# EAGLE design ML_Main_V1 (EAGLE 9.2.2)
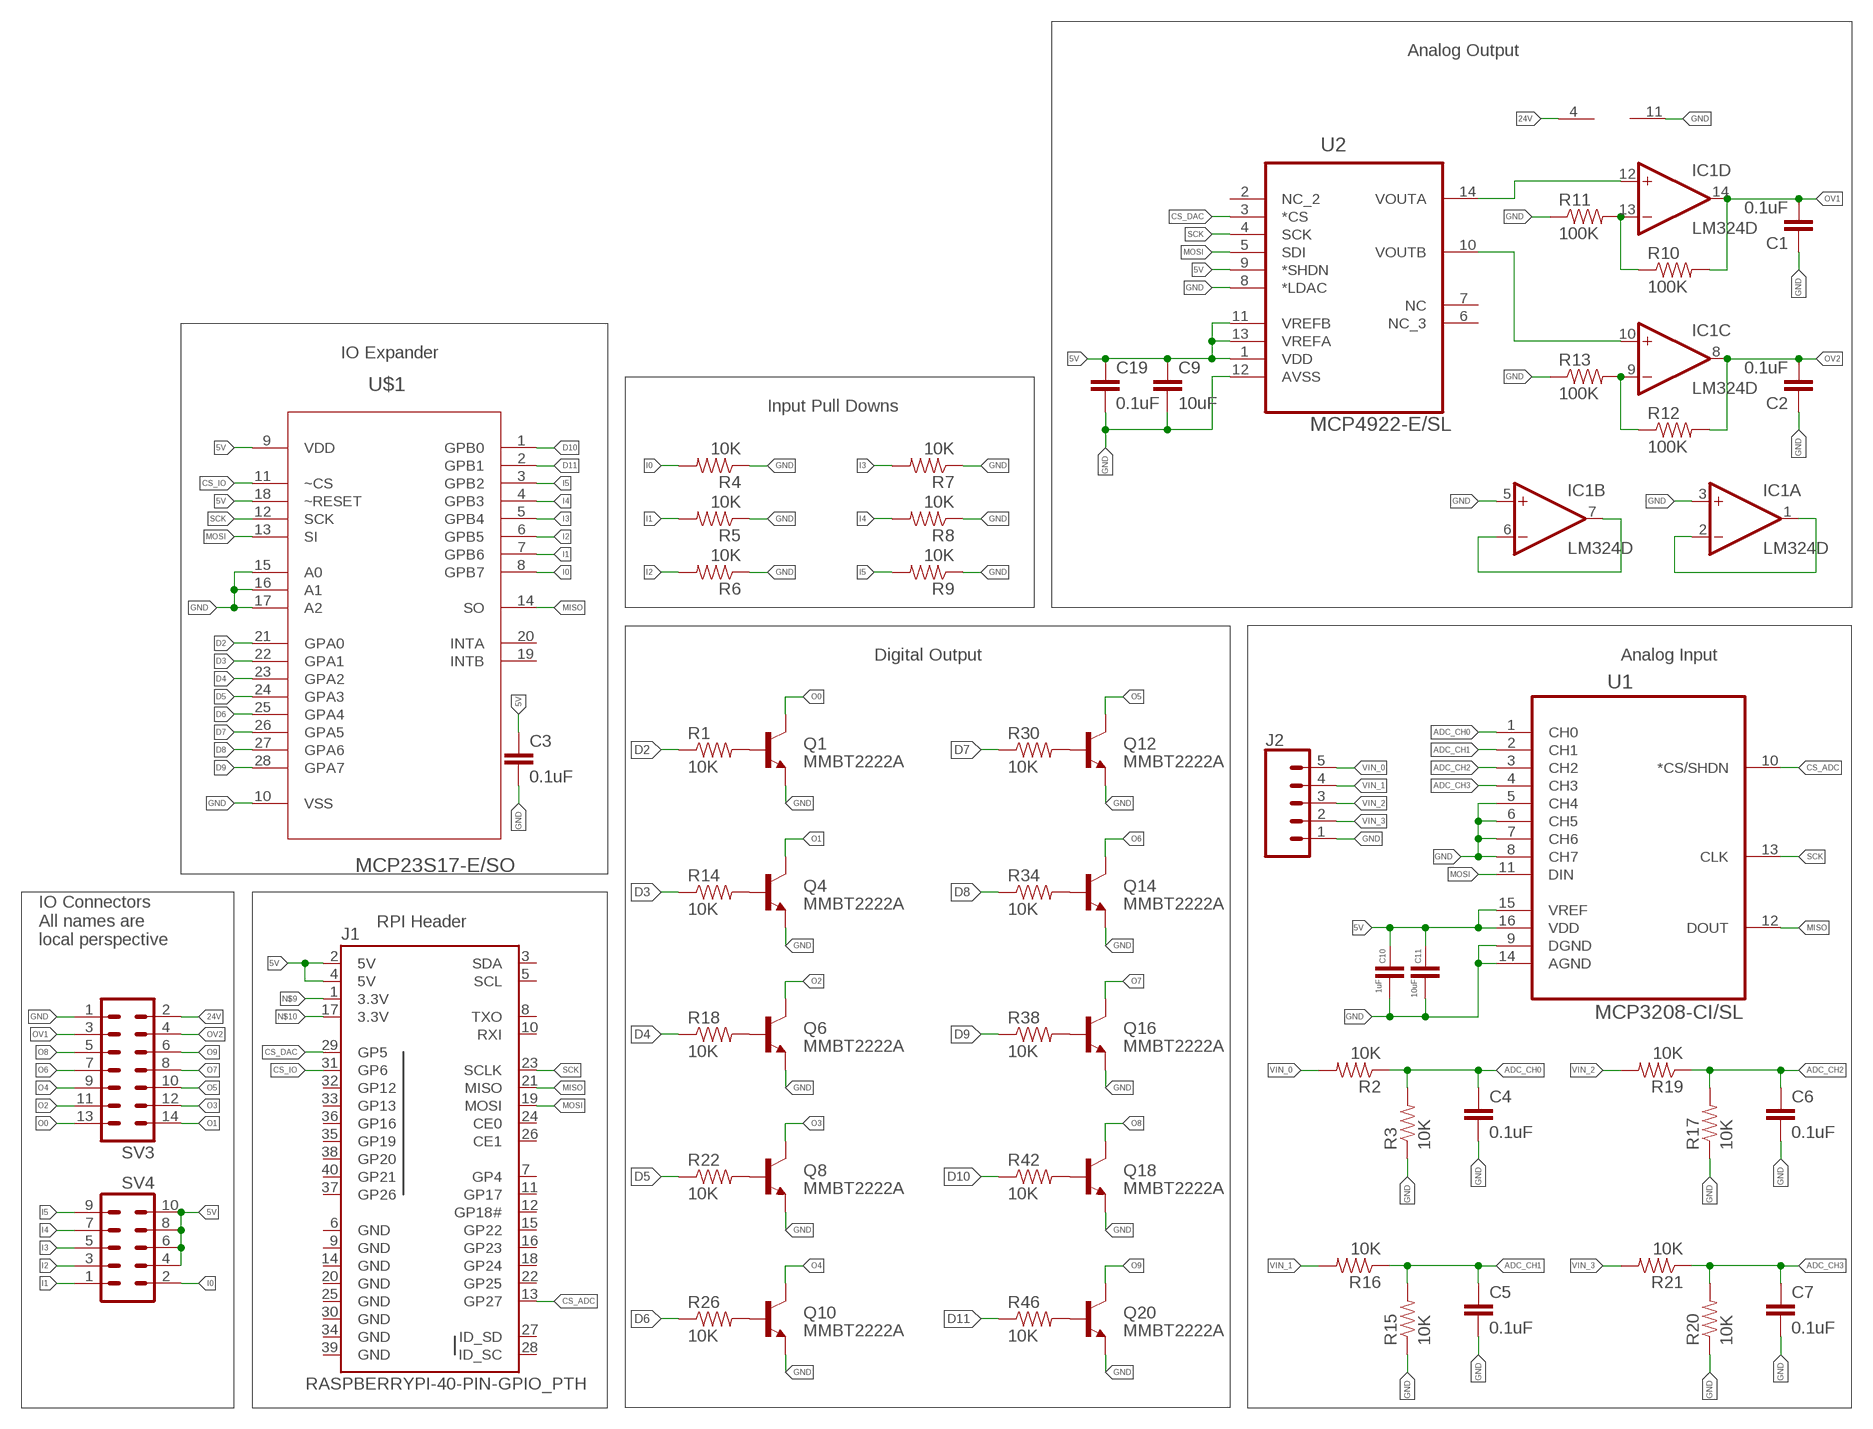
[diagram p0: schematic, sheet 1]

## Parts
C1  0.1uF  CAP0603-CAP  [0603-CAP]
C2  0.1uF  CAP0603-CAP  [0603-CAP]
C3  0.1uF  CAP0603-CAP  [0603-CAP]
C4  0.1uF  CAP0603-CAP  [0603-CAP]
C5  0.1uF  CAP0603-CAP  [0603-CAP]
C6  0.1uF  CAP0603-CAP  [0603-CAP]
C7  0.1uF  CAP0603-CAP  [0603-CAP]
C9  10uF  CAP0603-CAP  [0603-CAP]
C10  1uF  CAP0603-CAP  [0603-CAP]
C11  10uF  CAP0603-CAP  [0603-CAP]
C19  0.1uF  CAP0603-CAP  [0603-CAP]
IC1  LM324D  [SO14]
J1  RASPBERRYPI-40-PIN-GPIO_PTH  [2X20_SHROUDED]
J2  CONN_05SCREW  [SCREWTERMINAL-3.5MM-5]
Q1  MMBT2222A  TRANSISTOR_NPNMMBT2222A  [SOT23-3]
Q4  MMBT2222A  TRANSISTOR_NPNMMBT2222A  [SOT23-3]
Q6  MMBT2222A  TRANSISTOR_NPNMMBT2222A  [SOT23-3]
Q8  MMBT2222A  TRANSISTOR_NPNMMBT2222A  [SOT23-3]
Q10  MMBT2222A  TRANSISTOR_NPNMMBT2222A  [SOT23-3]
Q12  MMBT2222A  TRANSISTOR_NPNMMBT2222A  [SOT23-3]
Q14  MMBT2222A  TRANSISTOR_NPNMMBT2222A  [SOT23-3]
Q16  MMBT2222A  TRANSISTOR_NPNMMBT2222A  [SOT23-3]
Q18  MMBT2222A  TRANSISTOR_NPNMMBT2222A  [SOT23-3]
Q20  MMBT2222A  TRANSISTOR_NPNMMBT2222A  [SOT23-3]
R1  10K  RESISTOR0603-RES  [0603-RES]
R2  10K  RESISTOR0603-RES  [0603-RES]
R3  10K  RESISTOR0603-RES  [0603-RES]
R4  10K  RESISTOR0603-RES  [0603-RES]
R5  10K  RESISTOR0603-RES  [0603-RES]
R6  10K  RESISTOR0603-RES  [0603-RES]
R7  10K  RESISTOR0603-RES  [0603-RES]
R8  10K  RESISTOR0603-RES  [0603-RES]
R9  10K  RESISTOR0603-RES  [0603-RES]
R10  100K  RESISTOR0603-RES  [0603-RES]
R11  100K  RESISTOR0603-RES  [0603-RES]
R12  100K  RESISTOR0603-RES  [0603-RES]
R13  100K  RESISTOR0603-RES  [0603-RES]
R14  10K  RESISTOR0603-RES  [0603-RES]
R15  10K  RESISTOR0603-RES  [0603-RES]
R16  10K  RESISTOR0603-RES  [0603-RES]
R17  10K  RESISTOR0603-RES  [0603-RES]
R18  10K  RESISTOR0603-RES  [0603-RES]
R19  10K  RESISTOR0603-RES  [0603-RES]
R20  10K  RESISTOR0603-RES  [0603-RES]
R21  10K  RESISTOR0603-RES  [0603-RES]
R22  10K  RESISTOR0603-RES  [0603-RES]
R26  10K  RESISTOR0603-RES  [0603-RES]
R30  10K  RESISTOR0603-RES  [0603-RES]
R34  10K  RESISTOR0603-RES  [0603-RES]
R38  10K  RESISTOR0603-RES  [0603-RES]
R42  10K  RESISTOR0603-RES  [0603-RES]
R46  10K  RESISTOR0603-RES  [0603-RES]
SV3  MA07-2W  [MA07-2W]
SV4  MA05-2  [MA05-2]
U1  MCP3208-CI/SL  [SOIC127P600X175-16N]
U2  MCP4922-E/SL  [SOIC127P600X175-14N]
U$1  MCP23S17-E/SO  [SOIC127P030X265-28N]

## Nets
5V: C3.1 C9.1 C10.1 C11.1 C19.1 J1.2(5V) J1.4(5V) SV4.4 SV4.6 SV4.8 SV4.10 U1.15(VREF) U1.16(VDD) U2.1(VDD) U2.9(*SHDN) U2.11(VREFB) U2.13(VREFA) U$1.9(VDD) U$1.18(~RESET)
24V: IC1.4(P:V+) SV3.2
ADC_CH0: C4.1 R2.1 R3.2 U1.1(CH0)
ADC_CH1: C5.1 R15.2 R16.1 U1.2(CH1)
ADC_CH2: C6.1 R17.2 R19.1 U1.3(CH2)
ADC_CH3: C7.1 R20.2 R21.1 U1.4(CH3)
CS_ADC: J1.13(GP27) U1.10(*CS/SHDN)
CS_DAC: J1.29(GP5) U2.3(*CS)
CS_IO: J1.31(GP6) U$1.11(~CS)
D2: R1.1 U$1.21(GPA0)
D3: R14.1 U$1.22(GPA1)
D4: R18.1 U$1.23(GPA2)
D5: R22.1 U$1.24(GPA3)
D6: R26.1 U$1.25(GPA4)
D7: R30.1 U$1.26(GPA5)
D8: R34.1 U$1.27(GPA6)
D9: R38.1 U$1.28(GPA7)
D10: R42.1 U$1.1(GPB0)
D11: R46.1 U$1.2(GPB1)
GND [ground]: C1.1 C2.1 C3.2 C4.2 C5.2 C6.2 C7.2 C9.2 C10.2 C11.2 C19.2 IC1.3(A:+IN) IC1.5(B:+IN) IC1.11(P:V-) J2.1 Q1.2(E) Q4.2(E) Q6.2(E) Q8.2(E) Q10.2(E) Q12.2(E) Q14.2(E) Q16.2(E) Q18.2(E) Q20.2(E) R3.1 R4.1 R5.1 R6.1 R7.1 R8.1 R9.1 R11.1 R13.1 R15.1 R17.1 R20.1 SV3.1 U1.5(CH4) U1.6(CH5) U1.7(CH6) U1.8(CH7) U1.9(DGND) U1.14(AGND) U2.8(*LDAC) U2.12(AVSS) U$1.10(VSS) U$1.15(A0) U$1.16(A1) U$1.17(A2)
I0: R4.2 SV4.2 U$1.8(GPB7)
I1: R5.2 SV4.1 U$1.7(GPB6)
I2: R6.2 SV4.3 U$1.6(GPB5)
I3: R7.2 SV4.5 U$1.5(GPB4)
I4: R8.2 SV4.7 U$1.4(GPB3)
I5: R9.2 SV4.9 U$1.3(GPB2)
MISO: J1.21(MISO) U1.12(DOUT) U$1.14(SO)
MOSI: J1.19(MOSI) U1.11(DIN) U2.5(SDI) U$1.13(SI)
N$1: IC1.13(D:-IN) R10.1 R11.2
N$2: Q1.1(B) R1.2
N$3: IC1.10(C:+IN) U2.10(VOUTB)
N$4: IC1.12(D:+IN) U2.14(VOUTA)
N$5: IC1.9(C:-IN) R12.1 R13.2
N$6: IC1.1(A:OUT) IC1.2(A:-IN)
N$7: IC1.6(B:-IN) IC1.7(B:OUT)
N$8: Q4.1(B) R14.2
N$9: J1.1(3.3V)
N$10: J1.17(3.3V)
N$11: Q6.1(B) R18.2
N$14: Q8.1(B) R22.2
N$17: Q10.1(B) R26.2
N$22: Q12.1(B) R30.2
N$25: Q14.1(B) R34.2
N$28: Q16.1(B) R38.2
N$31: Q18.1(B) R42.2
N$34: Q20.1(B) R46.2
O0 [signal_out]: Q1.3(C) SV3.13
O1 [signal_out]: Q4.3(C) SV3.14
O2 [signal_out]: Q6.3(C) SV3.11
O3 [signal_out]: Q8.3(C) SV3.12
O4 [signal_out]: Q10.3(C) SV3.9
O5 [signal_out]: Q12.3(C) SV3.10
O6 [signal_out]: Q14.3(C) SV3.7
O7 [signal_out]: Q16.3(C) SV3.8
O8 [signal_out]: Q18.3(C) SV3.5
O9 [signal_out]: Q20.3(C) SV3.6
OV1: C1.2 IC1.14(D:OUT) R10.2 SV3.3
OV2: C2.2 IC1.8(C:OUT) R12.2 SV3.4
SCK: J1.23(SCLK) U1.13(CLK) U2.4(SCK) U$1.12(SCK)
VIN_0: J2.5 R2.2
VIN_1: J2.4 R16.2
VIN_2: J2.3 R19.2
VIN_3: J2.2 R21.2
Unconnected: J1.3(SDA) J1.5(SCL) J1.7(GP4) J1.8(TXO) J1.10(RXI) J1.11(GP17) J1.12(GP18#) J1.15(GP22) J1.16(GP23) J1.18(GP24) J1.22(GP25) J1.24(CE0) J1.26(CE1) J1.27(ID_SD) J1.28(ID_SC) J1.32(GP12) J1.33(GP13) J1.35(GP19) J1.36(GP16) J1.37(GP26) J1.38(GP20) J1.40(GP21) U2.2(NC_2) U2.6(NC_3) U2.7(NC) U$1.19(INTB) U$1.20(INTA)

## Notes on the sheet
- Analog Output
- IO Expander
- Input Pull Downs
- Digital Output | Analog Input
- RPI Header
- IO Connectors
  All names are 
  local perspective

## Power pins joined to a net without a drawn wire
GND: J1.6(GND) J1.9(GND) J1.14(GND) J1.20(GND) J1.25(GND) J1.30(GND) J1.34(GND) J1.39(GND)

## Library data of the parts
C1-C7 C9 C19 = SparkFun-Capacitors:CAP: Capacitor Standard 0603 ceramic capacitor, and 0.1" leaded capacitor.
C10 C11 = SparkFun-Passives:CAP: Capacitor Standard 0603 ceramic capacitor, and 0.1" leaded capacitor.
IC1 = linear:LM324: OP AMP
J1 = SparkFun-Connectors:RASPBERRYPI-40-PIN-GPIO: Raspberry Pi GPIO Header 2x20 pin connector, as found on B, B+, A+ models. Both shrouded PTH and SMT versions available. SparkFun Products: GPIO Shrouded Header <https://www.sparkfun.com/products/13054>- PTH SparkFun Pi Wedge (Preassembled) <https://www.sparkfun.com/products/13717>; PROD_ID: CONN-12263; SF_ID: PRT-13054
J2 = SparkFun-Connectors:CONN_05: Multi connection point. Often used as Generic Header-pin footprint for 0.1 inch spaced/style header connections On any of the 0.1 inch spaced packages, you can populate with these: Break Away Headers - Straight <https://www.sparkfun.com/products/116> (PRT-00116) Break Away Male Headers - Right Angle <https://www.sparkfun.com/products/553> (PRT-00553) Female Headers <https://www.sparkfun.com/products/115> (PRT-00115) Break Away Headers - Machine Pin <https://www.sparkfun.com/products/117> (PRT-00117) Break Away Female Headers - Swiss Machine Pin <https://www.sparkfun.com/products/743> (PRT-00743) For SCREWTERMINALS and SPRING TERMINALS visit here: Screw Terimnals on SparkFun.com <https://www.sparkfun.com/search/results?term=Screw+Terminals> (5mm/3.5mm/2.54mm spacing) This device is also useful as a general connection point to wire up your design to another part of your project. Our various solder wires solder well into these plated through hole pads. Hook-Up Wire - Assortment (Stranded, 22 AWG) <https://www.sparkfun.com/products/11375> (PRT-11375) Hook-Up Wire - Assortment (Solid Core, 22 AWG) <https://www.sparkfun.com/products/11367> (PRT-11367) View the entire wire category on our website here <https://www.sparkfun.com/categories/141> Special notes: Molex polarized connector foot print use with SKU : PRT-08231 with associated crimp pins and housings. 1MM SMD Version SKU: PRT-10208; PROD_ID: Combine 8288+8399
Q1 Q4 Q6 Q8 Q10 Q12 Q14 Q16 Q18 Q20 = SparkFun-DiscreteSemi:TRANSISTOR_NPN: Generic NPN BJT MMBT2222A - TRANS-08049 (SOT-23, 1A 40V) MPSA42 - TRANS-09116 (SOT-23, 500mA 300V) MMBT5088LT1G - TRANS-11160 (SOT-23, 50 mA 30V) BC547 - COM-08928 <http://www.sparkfun.com/products/8928> (TO-92 45V 100mA) (1.Collector 2.Base 3.Emitter) 2N3904 - COM-00521 <http://www.sparkfun.com/products/521> (TO-92 40V 200mA) (1.Emitter 2.Base 3.Collector) P2N2222A - COM-12852 <http://www.sparkfun.com/products/12852> (TO-92 40V 600mA) (1.Collector 2.Base 3.Emitter); PROD_ID: TRANS-08049
R1-R22 R26 R30 R34 R38 R42 R46 = SparkFun-Passives:RESISTOR: Resistor Basic schematic elements and footprints for 0603, 1206, and PTH resistors.
SV3 = con-lstb:MA07-2W: PIN HEADER; OC_FARNELL: unknown; OC_NEWARK: unknown
SV4 = con-lstb:MA05-2: PIN HEADER; OC_FARNELL: unknown; OC_NEWARK: unknown
U1 = Microchip_By_element14_Batch_1:MCP3208-CI/SL: IC, 12 ADC, SMD, 3208; MPN: MCP3208-CI/SL; OC_FARNELL: 1084270; OC_NEWARK: 69K7605; PACKAGE: SOIC16; SUPPLIER: Microchip
U2 = Microchip_By_element14_Batch_1:MCP4922-E/SL: IC, 12BIT DAC DUAL, SPI I/F; MPN: MCP4922-E/SL; OC_FARNELL: 1332114; OC_NEWARK: 08J8748; PACKAGE: SOIC14; SUPPLIER: Microchip
U$1 = Microchip_By_element14_Batch_1:MCP23S17-E/SO: 16-Bit I/O Expander; DESCRIPTION: IC I/O EXPANDER; MPN: MCP23S17-E/SO; OC_FARNELL: 1332093; OC_NEWARK: 31K2950; PACKAGE: SOIC-28; SUPPLIER: Microchip

## Net classes
0 default: width 0.254 mm, clearance 0.254 mm
1 ground: width 0.508 mm, clearance 0.205 mm to class 0, clearance 0.254 mm
2 signal_out: width 0.254 mm, clearance 0.205 mm to class 0, clearance 0.205 mm to class 1, clearance 0.254 mm

## Board
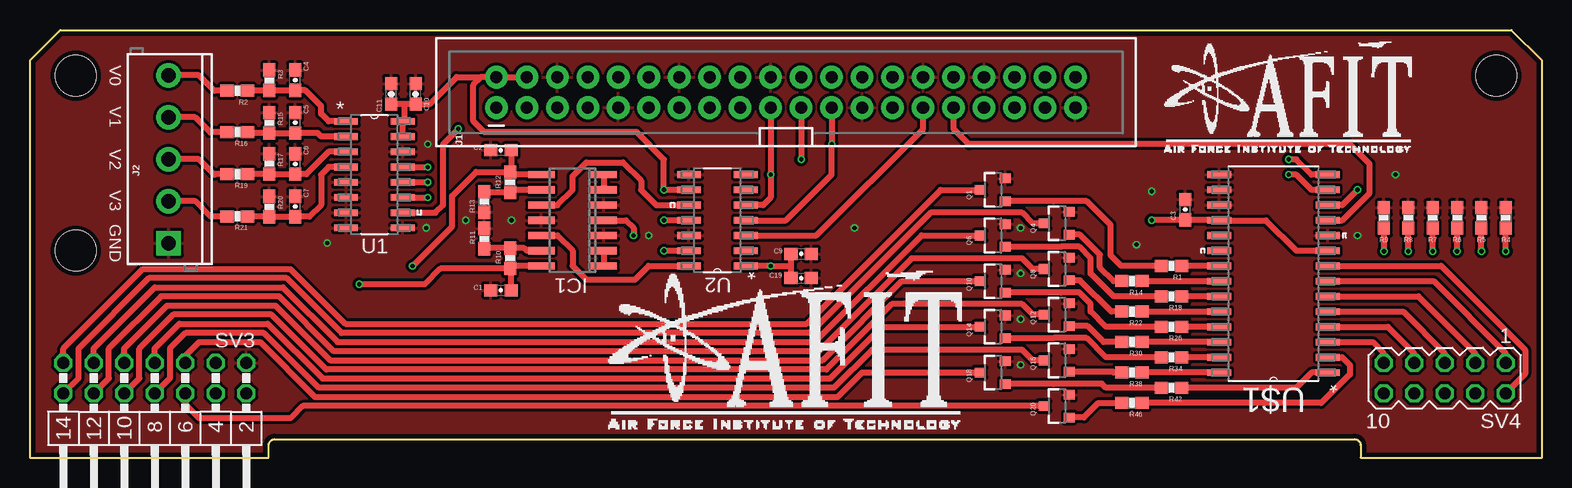
[diagram p1: board, top side]
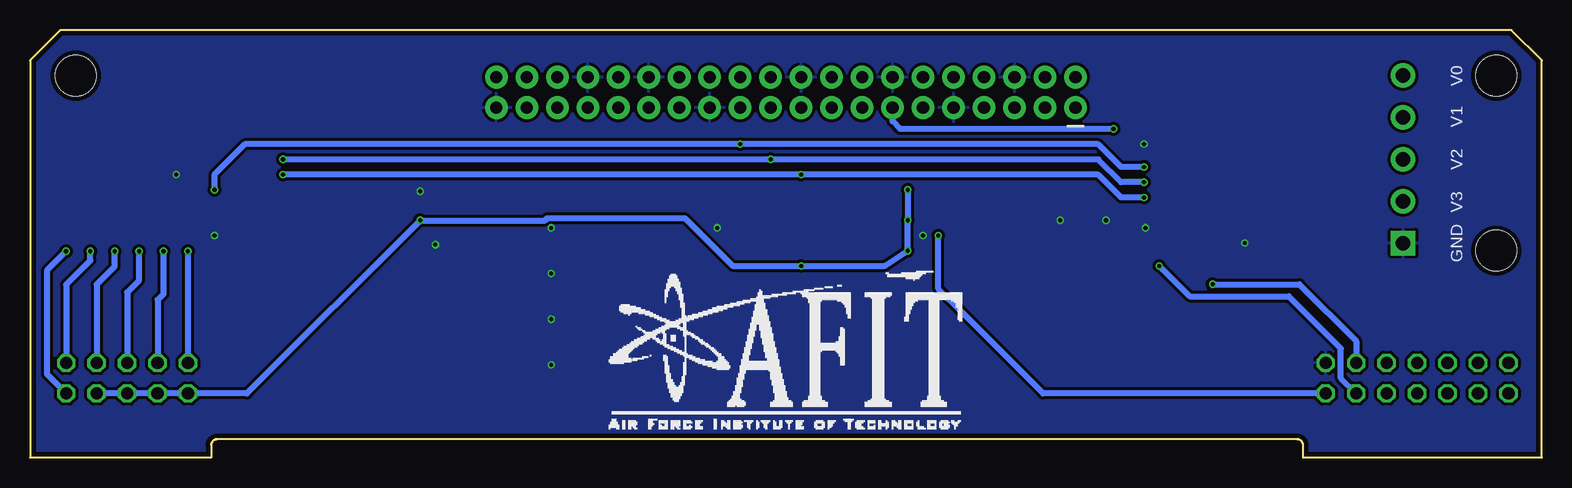
[diagram p2: board, bottom side, seen from below]

Size 125.98 x 35.69 mm. Coordinates in mm from the lower left corner, seen from the top.
Outline: 0,0 19.89,0 19.89,1.04 arc-90 20.39,1.54 110.39,1.54 arc-90 110.89,1.04 110.89,0 125.98,0 125.98,33.15 123.44,35.69 2.54,35.69 0,33.15 0,0
Copper layers (1*16): Top 0.035559375mm / dielectric 1.6mm / Bottom 0.035559375mm
Design rules "oshpark-2layer": minimum track width 6mil, minimum drill 10mil, track to track 6mil, track to pad 6mil, pad to pad 6mil, via to via 6mil, smd to smd 6mil, copper to edge 15mil, drill to drill 6mil, minimum pad ring 5mil, minimum via ring 5mil, stop-mask expansion 2.5mil, vias tented up to drill 0mil, thermal gap 10mil
Holes 3.4 mm at 122.17,31.88 3.81,31.88 3.81,17.27

### Footprints (pad centres in the part's own frame; a part is rotated, then mirrored left to right if it is on the bottom)
0603-CAP = smd 1.1 x 1: 1 -0.85,0; 2 0.85,0
SO14 = smd 0.6 x 2.2: 1 -3.81,-2.6; 2 -2.54,-2.6; 3 -1.27,-2.6; 4 0,-2.6; 5 1.27,-2.6; 6 2.54,-2.6; 7 3.81,-2.6; 8 3.81,2.6; 9 2.54,2.6; 10 1.27,2.6; 11 0,2.6; 12 -1.27,2.6; 13 -2.54,2.6; 14 -3.81,2.6
2X20_SHROUDED = drill 1.016 pad 1.88: 1 -1.27,24.13; 2 1.27,24.13; 3 -1.27,21.59; 4 1.27,21.59; 5 -1.27,19.05; 6 1.27,19.05; 7 -1.27,16.51; 8 1.27,16.51; 9 -1.27,13.97; 10 1.27,13.97; 11 -1.27,11.43; 12 1.27,11.43; 13 -1.27,8.89; 14 1.27,8.89; 15 -1.27,6.35; 16 1.27,6.35; 17 -1.27,3.81; 18 1.27,3.81; 19 -1.27,1.27; 20 1.27,1.27; 21 -1.27,-1.27; 22 1.27,-1.27; 23 -1.27,-3.81; 24 1.27,-3.81; 25 -1.27,-6.35; 26 1.27,-6.35; 27 -1.27,-8.89; 28 1.27,-8.89; 29 -1.27,-11.43; 30 1.27,-11.43; 31 -1.27,-13.97; 32 1.27,-13.97; 33 -1.27,-16.51; 34 1.27,-16.51; 35 -1.27,-19.05; 36 1.27,-19.05; 37 -1.27,-21.59; 38 1.27,-21.59; 39 -1.27,-24.13; 40 1.27,-24.13
SCREWTERMINAL-3.5MM-5 = drill 1.2 pad 2.032 square: 1 0,0 | drill 1.2 pad 2.032: 2 3.5,0; 3 7,0; 4 10.5,0; 5 14,0
SOT23-3 = smd 0.8 x 0.9: 1 -0.95,-1; 2 0.95,-1; 3 0,1.1
0603-RES = smd 1.1 x 1: 1 -0.85,0; 2 0.85,0
MA07-2W = drill 1.016 octagon: 1 -7.62,-1.27; 2 -7.62,1.27; 3 -5.08,-1.27; 4 -5.08,1.27; 5 -2.54,-1.27; 6 -2.54,1.27; 7 0,-1.27; 8 0,1.27; 9 2.54,-1.27; 10 2.54,1.27; 11 5.08,-1.27; 12 5.08,1.27; 13 7.62,-1.27; 14 7.62,1.27
MA05-2 = drill 1.016 octagon: 1 -5.08,-1.27; 2 -5.08,1.27; 3 -2.54,-1.27; 4 -2.54,1.27; 5 0,-1.27; 6 0,1.27; 7 2.54,-1.27; 8 2.54,1.27; 9 5.08,-1.27; 10 5.08,1.27
SOIC127P600X175-16N = smd 1.981 x 0.559: 1 -2.362,4.445; 2 -2.362,3.175; 3 -2.362,1.905; 4 -2.362,0.635; 5 -2.362,-0.635; 6 -2.362,-1.905; 7 -2.362,-3.175; 8 -2.362,-4.445; 9 2.362,-4.445; 10 2.362,-3.175; 11 2.362,-1.905; 12 2.362,-0.635; 13 2.362,0.635; 14 2.362,1.905; 15 2.362,3.175; 16 2.362,4.445
SOIC127P600X175-14N = smd 1.981 x 0.559: 1 -2.362,3.81; 2 -2.362,2.54; 3 -2.362,1.27; 4 -2.362,0; 5 -2.362,-1.27; 6 -2.362,-2.54; 7 -2.362,-3.81; 8 2.362,-3.81; 9 2.362,-2.54; 10 2.362,-1.27; 11 2.362,0; 12 2.362,1.27; 13 2.362,2.54; 14 2.362,3.81
SOIC127P030X265-28N = smd 1.981 x 0.559: 1 -4.521,8.255; 2 -4.521,6.985; 3 -4.521,5.715; 4 -4.521,4.445; 5 -4.521,3.175; 6 -4.521,1.905; 7 -4.521,0.635; 8 -4.521,-0.635; 9 -4.521,-1.905; 10 -4.521,-3.175; 11 -4.521,-4.445; 12 -4.521,-5.715; 13 -4.521,-6.985; 14 -4.521,-8.255; 15 4.521,-8.255; 16 4.521,-6.985; 17 4.521,-5.715; 18 4.521,-4.445; 19 4.521,-3.175; 20 4.521,-1.905; 21 4.521,-0.635; 22 4.521,0.635; 23 4.521,1.905; 24 4.521,3.175; 25 4.521,4.445; 26 4.521,5.715; 27 4.521,6.985; 28 4.521,8.255

### Placement (x,y rotation side)
C1  39.24,13.97 0 top
C2  39.24,25.65 0 top
C3  96.27,20.7 90 top
C4  22.1,31.5 90 top
C5  22.1,27.94 90 top
C6  22.1,24.51 90 top
C7  22.1,20.96 90 top
C9  64.26,17.02 0 top
C10  32.13,30.35 90 top
C11  30.1,30.35 90 top
C19  64.26,14.99 0 top
IC1  45.21,19.81 90 top
J1  62.99,30.48 90 top
J2  11.56,17.91 90 top
Q1  80.26,22.35 90 top
Q4  85.6,19.56 90 top
Q6  80.26,18.54 90 top
Q8  85.6,15.75 90 top
Q10  80.26,14.73 90 top
Q12  85.6,11.94 90 top
Q14  80.26,10.92 90 top
Q16  85.6,8.13 90 top
Q18  80.26,7.11 90 top
Q20  85.6,4.32 90 top
R1  95.12,16 180 top
R2  17.27,30.61 180 top
R3  19.94,31.5 270 top
R4  122.99,20.02 270 top
R5  120.95,20.02 270 top
R6  118.92,20.02 270 top
R7  116.89,20.02 270 top
R8  114.86,20.02 270 top
R9  112.83,20.02 270 top
R10  40,16.64 270 top
R11  37.85,18.29 270 top
R12  40,22.99 90 top
R13  37.85,21.34 90 top
R14  91.82,14.73 180 top
R15  19.94,27.94 270 top
R16  17.27,27.15 180 top
R17  19.94,24.51 270 top
R18  95.12,13.46 180 top
R19  17.27,23.65 180 top
R20  19.94,20.96 270 top
R21  17.27,20.14 180 top
R22  91.82,12.19 180 top
R26  95.12,10.92 180 top
R30  91.82,9.65 180 top
R34  95.12,8.38 180 top
R38  91.82,7.11 180 top
R42  95.12,5.84 180 top
R46  91.82,4.57 180 top
SV3  10.39,6.64 180 top
SV4  117.89,6.64 180 top
U1  28.7,23.62 0 top
U2  57.28,19.81 180 top
U$1  103.63,15.37 180 top

### Tracks (layer width: path | path; a pad name or v marks a point on that pad's centre or on a via)
5V  (via drill 0.35)
  Top 0.508: U1.15 U1.16 31.24,28.25 31.24,29.5 | 31.24,29.5 C10.1 33.31,29.5 35.56,31.75 37.59,31.75 | 31.24,29.5 C11.1 | U$1.9 105.54,17.27 103,19.81 U$1.18 99.07,19.85 C3.1 93.51,19.85 v93.47,19.81 | J1.4 J1.2 37.59,31.75 | U2.1 v61.72,16 63.41,16 | v52.83,17.27 U2.13 | U2.11 v52.83,19.81 | C9.1 63.41,16 | 63.41,16 C19.1 | 37.59,31.75 36.96,31.12 36.96,28.07 37.85,27.18 50.55,27.18 52.83,24.89 v52.83,22.35 U2.9
  Bottom 0.508: v52.83,22.35 v52.83,19.81 v52.83,17.27 54.74,16 v61.72,16 67.44,16 71.42,19.99 82.89,19.99 83.06,19.81 v93.47,19.81 107.91,5.37 SV4.10 SV4.8 SV4.6 SV4.4
24V  (via drill 0.35)
  Top 0.508: IC1.4 49.66,19.81 50.29,19.18 v50.29,18.54
  Bottom 0.508: v50.29,18.54 50.29,14.1 48.39,12.19 41.57,5.37 SV3.2
ADC_CH0
  Top 0.508: U1.1 24.89,28.07 24.26,28.7 24.26,29.34 22.95,30.65 C4.1 R3.2 19.9,30.61 R2.1
ADC_CH1
  Top 0.508: U1.2 24.26,26.8 23.96,27.09 C5.1 R15.2 18.19,27.09 R16.1
ADC_CH2
  Top 0.508: U1.3 24.89,25.53 23.03,23.66 C6.1 R17.2 18.14,23.66 R19.1
ADC_CH3
  Top 0.508: U1.4 24.89,24.26 24.26,23.62 24.26,21.08 23.28,20.11 C7.1 R20.2 18.16,20.11 R21.1
CS_ADC  (via drill 0.35)
  Top 0.508: U1.10 33.78,20.45 34.42,21.08 34.42,26.16 v35.69,27.43
  Bottom 0.508: v35.69,27.43 53.47,27.43 54.1,28.07 J1.13
CS_DAC
  Top 0.508: U2.3 65.53,18.54 74.42,27.43 J1.29
CS_IO
  Top 0.508: U$1.11 109.35,19.81 111.63,22.1 111.63,24.51 109.98,26.16 78.23,26.16 76.96,27.43 J1.31
D2
  Top 0.508: U$1.21 R1.1
D3
  Top 0.508: R14.1 U$1.22
D4
  Top 0.508: U$1.23 R18.1
D5
  Top 0.508: R22.1 U$1.24
D6
  Top 0.508: U$1.25 R26.1
D7
  Top 0.508: U$1.26 R30.1
D8
  Top 0.508: U$1.27 R34.1
D9
  Top 0.508: U$1.28 R38.1
D10
  Top 0.508: U$1.1 106.81,7.11 105.54,5.84 R42.1
D11
  Top 0.508: U$1.2 109.35,8.38 109.98,7.75 109.98,6.95 107.6,4.57 R46.1
GND  (via drill 0.35)
  other vias: 82.55,7.75 82.55,11.56 82.55,15.37 82.55,19.18 68.71,19.18 40.13,19.81 36.32,19.81 24.77,17.91 33.02,19.18 33.15,26.16 113.79,23.62 92.2,17.78 51.56,18.54 93.47,22.23 110.62,18.54
  pour Bottom: -2.41,-3.05 128.4,-3.05 128.4,38.23 -2.41,38.23
  pour Top: -4.32,-4.95 130.3,-4.95 130.3,40.13 -4.32,40.13
I0  (via drill 0.35)
  Top 0.508: v122.99,17.22 R4.2 | U$1.8 117.6,16 123.95,9.65 124.59,9.02 124.59,6.99 SV4.2
  Bottom 0.508: v122.99,17.22 124.59,15.62 124.59,6.99 SV4.2
I1  (via drill 0.35)
  Top 0.508: v120.95,17.22 R5.2 | U$1.7 116.97,14.73 122.97,8.73 SV4.1
  Bottom 0.508: v120.95,17.22 120.95,16.46 122.97,14.44 SV4.1
I2  (via drill 0.35)
  Top 0.508: v118.92,17.22 R6.2 | U$1.6 115.7,13.46 120.43,8.73 SV4.3
  Bottom 0.508: v118.92,17.22 118.92,15.95 120.43,14.44 SV4.3
I3  (via drill 0.35)
  Top 0.508: v116.89,17.22 R7.2 | U$1.5 114.43,12.19 117.89,8.73 SV4.5
  Bottom 0.508: v116.89,17.22 116.89,14.81 117.89,13.81 SV4.5
I4  (via drill 0.35)
  Top 0.508: v114.86,17.22 R8.2 | U$1.4 113.16,10.92 115.35,8.73 SV4.7
  Bottom 0.508: v114.86,17.22 114.86,13.66 115.35,13.17 SV4.7
I5  (via drill 0.35)
  Top 0.508: U$1.3 111.89,9.65 112.81,8.73 SV4.9 | R9.2 v112.83,17.22
  Bottom 0.508: v112.83,17.22 112.83,7.93 SV4.9
MISO  (via drill 0.35)
  Top 0.508: U1.12 v33.15,22.99 | J1.21 v64.26,24.89 | U$1.14 106.81,23.62 105.54,24.89 v104.9,24.89
  Bottom 0.508: v33.15,22.99 35.05,22.99 36.96,24.89 v64.26,24.89 v104.9,24.89
MOSI  (via drill 0.35)
  Top 0.508: U1.11 v33.15,21.72 | J1.19 v61.72,23.62 61.72,21.72 61.09,21.08 U2.5 | U$1.13 106.81,22.35 105.54,23.62 v104.9,23.62
  Bottom 0.508: v104.9,23.62 v61.72,23.62 36.96,23.62 35.05,21.72 v33.15,21.72
N$1
  Top 0.508: IC1.13 41.4,17.27 41.19,17.49 R10.1 37.89,17.49 R11.2
N$2
  Top 0.508: R1.2 90.93,16 90.04,16.89 90.04,19.43 88.06,21.42 85.3,21.42 85.29,21.4 Q1.1
N$3
  Top 0.508: IC1.10 43.94,21.08 45.21,22.35 45.21,23.5 46.35,24.64 49.4,24.64 50.93,23.11 50.93,22.35 52.2,21.08 U2.10
N$4
  Top 0.508: IC1.12 43.94,18.54 45.21,17.27 45.21,16 46.35,14.86 50.42,14.86 51.56,16 U2.14
N$5
  Top 0.508: IC1.9 40.22,22.35 R12.1 37.89,22.14 R13.2
N$6
  Top 0.508: IC1.2 IC1.1
N$7
  Top 0.508: IC1.7 IC1.6
N$8
  Top 0.508: R14.2 90.3,14.73 89.15,15.88 89.15,16.95 87.5,18.61 Q4.1
N$11
  Top 0.508: R18.2 90.3,13.46 88.39,15.37 88.39,16.64 87.42,17.61 85.94,17.61 85.92,17.59 Q6.1
N$14
  Top 0.508: Q8.1 87.5,14.8 90.11,12.19 R22.2
N$17
  Top 0.508: R26.2 89.66,10.92 88.39,12.19 88.39,12.83 87.42,13.8 85.94,13.8 85.92,13.78 Q10.1
N$22
  Top 0.508: R30.2 89.47,9.65 88.13,10.99 Q12.1
N$25
  Top 0.508: Q14.1 85.29,9.97 85.3,9.99 88.06,9.99 89.66,8.38 R34.2
N$28
  Top 0.508: R38.2 90.3,7.11 90.23,7.18 Q16.1
N$31
  Top 0.508: Q18.1 85.29,6.16 85.3,6.18 89.33,6.18 89.66,5.84 R42.2
N$34
  Top 0.508: Q20.1 87.82,3.37 89.03,4.57 R46.2
O0
  Top 0.508: Q1.3 75.88,22.35 64.71,11.18 26.27,11.18 21.7,15.75 9.4,15.75 2.77,9.12 SV3.13
O1
  Top 0.508: Q4.3 83.57,19.56 82.68,20.45 75.06,20.45 65.02,10.41 25.96,10.41 21.39,14.99 9.91,14.99 4.04,9.12 4.04,6.64 SV3.14
O2
  Top 0.508: Q6.3 74.31,18.54 65.42,9.65 25.64,9.65 21.07,14.22 10.41,14.22 5.31,9.12 SV3.11
O3
  Top 0.508: Q8.3 83.57,15.75 82.68,16.64 73.48,16.64 65.73,8.89 25.33,8.89 20.76,13.46 10.92,13.46 6.58,9.12 6.58,6.64 SV3.12
O4
  Top 0.508: Q10.3 72.65,14.73 66.05,8.13 25.01,8.13 20.44,12.7 11.43,12.7 7.85,9.12 SV3.9
O5
  Top 0.508: Q12.3 83.57,11.94 82.68,12.83 71.82,12.83 66.36,7.37 24.7,7.37 20.12,11.94 11.94,11.94 9.12,9.12 9.12,6.64 SV3.10
O6
  Top 0.508: Q14.3 71,10.92 66.68,6.6 24.38,6.6 19.81,11.18 12.45,11.18 10.39,9.12 SV3.7
O7
  Top 0.508: Q16.3 83.57,8.13 82.68,9.02 70.17,9.02 66.99,5.84 24.07,5.84 19.49,10.41 12.95,10.41 11.66,9.12 11.66,6.64 SV3.8
O8
  Top 0.508: Q18.3 69.34,7.11 67.31,5.08 23.75,5.08 19.18,9.65 14.1,9.65 12.93,8.49 SV3.5
O9
  Top 0.508: Q20.3 22.73,4.32 21.72,3.3 14.1,3.3 12.93,4.47 SV3.6
OV1  (via drill 0.35)
  Top 0.508: R10.2 40.22,16 IC1.14 | R10.2 39.97,15.75 40.09,15.62 C1.2 | R10.2 34.2,15.79 32.89,14.48 v27.43,14.48
  Bottom 0.508: v27.43,14.48 20.19,14.48 15.47,9.76 SV3.3
OV2  (via drill 0.35)
  Top 0.508: R12.2 40.22,23.62 IC1.8 | R12.2 39.97,23.88 40.09,24 C2.2 | v31.88,16 35.18,19.3 35.18,21.84 37.17,23.84 R12.2
  Bottom 0.508: v31.88,16 29.34,13.46 21.08,13.46 16.74,9.12 16.74,6.64 SV3.4
SCK  (via drill 0.35)
  Top 0.508: U1.13 v33.15,24.26 | v110.62,22.35 109.35,21.08 U$1.12 | J1.23 v66.8,26.16 66.8,23.62 62.99,19.81 U2.4
  Bottom 0.508: v33.15,24.26 35.05,24.26 36.96,26.16 v66.8,26.16 108.08,26.16 110.62,23.62 v110.62,22.35
VIN_0
  Top 0.508: R2.2 15.37,30.61 14.07,31.91 J2.5
VIN_1
  Top 0.508: R16.2 15.01,27.15 13.76,28.41 J2.4
VIN_2
  Top 0.508: R19.2 15.39,23.65 15.37,23.62 14.08,24.91 J2.3
VIN_3
  Top 0.508: R21.2 15.04,20.14 13.77,21.41 J2.2

### Text on the board
tPlace: V0 | V1 | V2 | V3 | GND
bPlace: V0 | V1 | V2 | V3 | GND
Reference: X | X